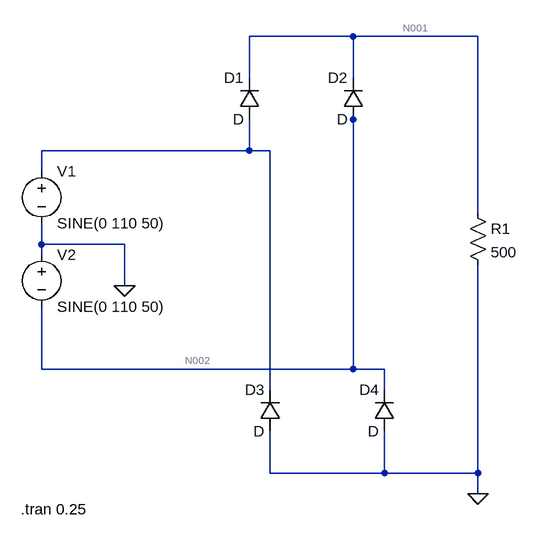
[diagram p0: schematic EEE_7.asc]
EEE_7.asc, the LTspice schematic file:
Version 4
SHEET 1 880 680
WIRE -128 -144 -288 -144
WIRE 64 -144 -128 -144
WIRE -288 -80 -288 -144
WIRE -128 -80 -128 -144
WIRE -128 -16 -128 -32
WIRE -288 32 -288 -16
WIRE -288 32 -608 32
WIRE -256 32 -288 32
WIRE -608 64 -608 32
WIRE 64 128 64 -144
WIRE -608 176 -608 144
WIRE -480 176 -608 176
WIRE -608 192 -608 176
WIRE -480 240 -480 176
WIRE -608 368 -608 272
WIRE -128 368 -128 -16
WIRE -128 368 -608 368
WIRE -80 368 -128 368
WIRE -256 400 -256 32
WIRE -80 400 -80 368
WIRE -256 528 -256 464
WIRE -80 528 -80 464
WIRE -80 528 -256 528
WIRE 64 528 64 208
WIRE 64 528 -80 528
WIRE 64 560 64 528
FLAG -480 240 0
FLAG 64 560 0
SYMBOL res 48 112 R0
SYMATTR InstName R1
SYMATTR Value 500
SYMBOL voltage -608 48 R0
WINDOW 123 0 0 Left 0
WINDOW 39 0 0 Left 0
SYMATTR InstName V1
SYMATTR Value SINE(0 110 50)
SYMBOL voltage -608 176 R0
WINDOW 123 0 0 Left 0
WINDOW 39 0 0 Left 0
SYMATTR InstName V2
SYMATTR Value SINE(0 110 50)
SYMBOL diode -272 -16 R180
WINDOW 0 24 64 Left 2
WINDOW 3 24 0 Left 2
SYMATTR InstName D1
SYMBOL diode -112 -16 R180
WINDOW 0 24 64 Left 2
WINDOW 3 24 0 Left 2
SYMATTR InstName D2
SYMBOL diode -240 464 R180
WINDOW 0 24 64 Left 2
WINDOW 3 24 0 Left 2
SYMATTR InstName D3
SYMBOL diode -64 464 R180
WINDOW 0 24 64 Left 2
WINDOW 3 24 0 Left 2
SYMATTR InstName D4
TEXT -640 584 Left 2 !.tran 0.25

The netlist it stands for:
* EEE_7.asc
R1 N001 0 500
V1 N003 0 SINE(0 110 50)
V2 0 N002 SINE(0 110 50)
D1 N003 N001 D
D2 N002 N001 D
D3 0 N003 D
D4 0 N002 D
.model D D
.lib standard.dio
.tran 0.25
.backanno
.end

* Results of the author's LTspice run, read from the files saved beside the schematic
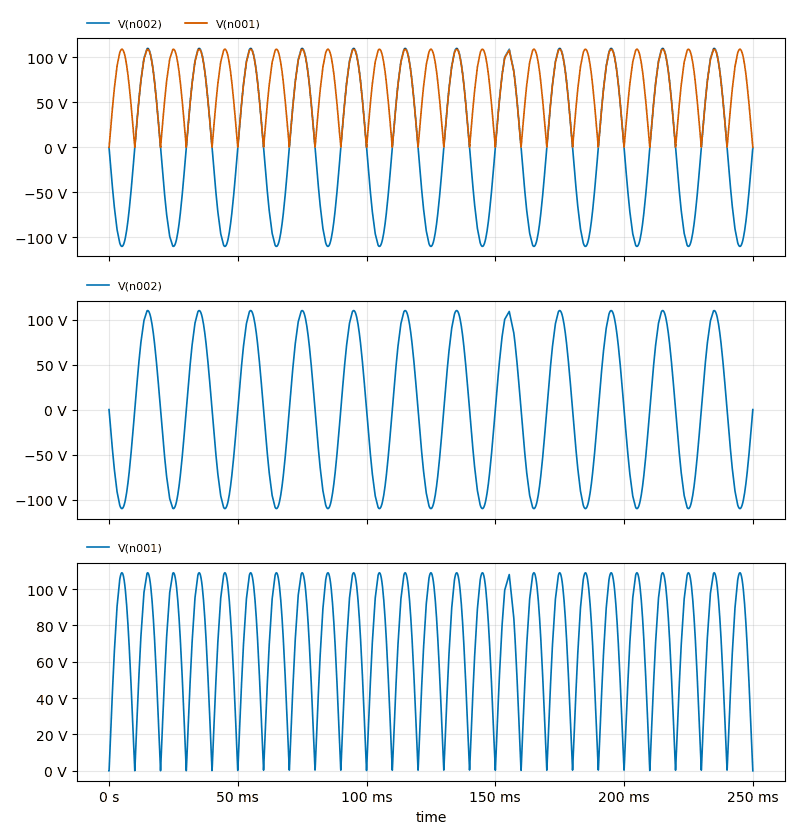
[diagram p1: Transient Analysis of EEE_7.asc, plotted from the saved traces]
* Transient Analysis, 1 run:
*   V(n002): min -110 V, max 110 V, average -2.834 V, rms 77.63 V, last 0 V
*   V(n001): min 0 V, max 109 V, average 68.89 V, rms 76.85 V, last 0 V
*   V(n002): min -110 V, max 110 V, average -2.834 V, rms 77.63 V, last 0 V
*   V(n001): min 0 V, max 109 V, average 68.89 V, rms 76.85 V, last 0 V